# Altium schematic sheet TemplateProject.SchDoc
size A4; SheetNumber: 1; SheetTotal: 1
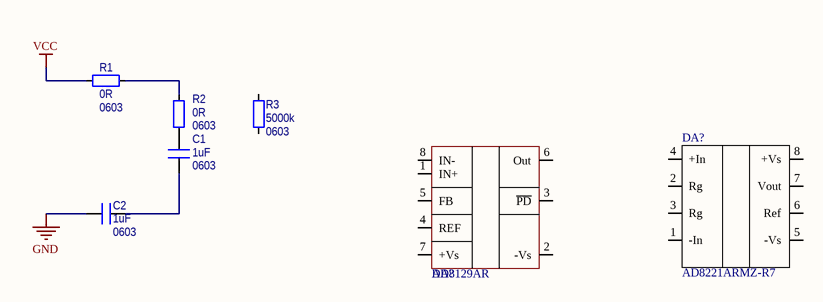
[diagram p0: TemplateProject.SchDoc]

## Parts
(Parts that share a designator on the sheet are numbered #1, #2 ... from top to bottom, then left to right.)
C1  value 1uF  Package: 0603  [CAPC1608(0603)N]  (hidden comment: C 0603 1uF 10V X5R)
C2  value 1uF  Package: 0603  [CAPC1608(0603)N]  (hidden comment: C 0603 1uF 10V X5R)
DA?#1  AD8129AR  [SO-8_N]
DA?#2  AD8221ARMZ-R7  [8uSOP_N]
R1  value 0R  Package: 0603  [RESC1608(0603)N]  (hidden comment: R 0603 0R 5%)
R2  value 0R  Package: 0603  [RESC1608(0603)N]  (hidden comment: R 0603 0R 5%)
R3  value 5000k  Package: 0603  [RESC1608(0603)N]  (hidden comment: R 0603 5000R %)

## Nets
GND: C2.1
VCC: R1.1
NetC1_1: C1.1 R2.1
NetC1_2: C1.2 C2.2
NetR1_2: R1.2 R2.2

Not connected (* = marked no-connect by the designer): DA?#1 1(IN+) 2(-Vs) 3(~{PD}) 4(REF) 5(FB) 6(Out) 7(+Vs) 8(IN-); DA?#2 1(-In) 2(Rg) 3(Rg) 4(+In) 5(-Vs) 6(Ref) 7(Vout) 8(+Vs); R3 1 2

## Library data of the parts
C1 C2 = C 0603 1uF 25V X7R: Voltage: *; Tolerance: *; Part Number: C 0603 1uF 25V X7R
DA?#1 = AD8129AR: Differential Amplifiers 200 MHz; Part Number: AD8129AR; HelpURL: http://eu.mouser.com/ProductDetail/Analog-Devices/AD8129ARZ/?qs=sGAEpiMZZMsFOcXqMdeHCZr1fvJ1U5LpDNuwvaufrWY%3d
DA?#2 = AD8221ARMZ-R7: Instrumentation Amplifier 1 Circuit 8-MSOP; Part Number: AD8221ARMZ-R7; HelpURL: http://www.analog.com/media/en/technical-documentation/data-sheets/AD8221.pdf; Price$: 2.82555
R1 = R 0603 0R 5%: =Part Number; Tolerance: 5%; MPN: *; Part Number: R 0603 0R 5%
R2 = R 0603 0R 5%: MPN: MPN value; Tolerance: 5%; Part Number: R 0603 0R 5%; Mouser Part Number: Mouser PN value
R3 = R 0603 generic: Tolerance: *; MPN: *; Part Number: R 0603 generic